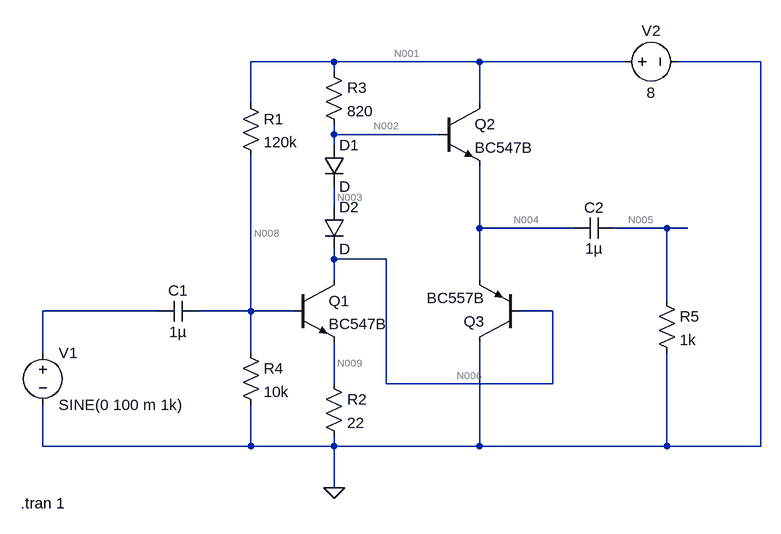
[diagram p0: schematic classAB.asc]
classAB.asc, the LTspice schematic file:
Version 4
SHEET 1 880 696
WIRE 128 0 0 0
WIRE 352 0 128 0
WIRE 576 0 352 0
WIRE 784 0 656 0
WIRE 128 16 128 0
WIRE 0 64 0 0
WIRE 352 64 352 0
WIRE 128 112 128 96
WIRE 288 112 128 112
WIRE 128 128 128 112
WIRE 128 224 128 192
WIRE 352 256 352 160
WIRE 496 256 352 256
WIRE 640 256 560 256
WIRE 672 256 640 256
WIRE 128 304 128 288
WIRE 208 304 128 304
WIRE 128 336 128 304
WIRE 352 336 352 256
WIRE 640 368 640 256
WIRE -144 384 -320 384
WIRE 0 384 0 144
WIRE 0 384 -80 384
WIRE 64 384 0 384
WIRE 464 384 416 384
WIRE -320 448 -320 384
WIRE 0 448 0 384
WIRE 128 496 128 432
WIRE 208 496 208 304
WIRE 464 496 464 384
WIRE 464 496 208 496
WIRE -320 592 -320 528
WIRE 0 592 0 528
WIRE 0 592 -320 592
WIRE 128 592 128 576
WIRE 128 592 0 592
WIRE 352 592 352 432
WIRE 352 592 128 592
WIRE 640 592 640 448
WIRE 640 592 352 592
WIRE 784 592 784 0
WIRE 784 592 640 592
WIRE 128 656 128 592
FLAG 128 656 0
SYMBOL res -16 48 R0
SYMATTR InstName R1
SYMATTR Value 120k
SYMBOL res 112 0 R0
SYMATTR InstName R3
SYMATTR Value 820
SYMBOL diode 112 128 R0
SYMATTR InstName D1
SYMBOL diode 112 224 R0
SYMATTR InstName D2
SYMBOL npn 64 336 R0
SYMATTR InstName Q1
SYMATTR Value BC547B
SYMBOL npn 288 64 R0
SYMATTR InstName Q2
SYMATTR Value BC547B
SYMBOL res 112 480 R0
SYMATTR InstName R2
SYMATTR Value 22
SYMBOL res -16 432 R0
SYMATTR InstName R4
SYMATTR Value 10k
SYMBOL cap -80 368 R90
WINDOW 0 0 32 VBottom 2
WINDOW 3 32 32 VTop 2
SYMATTR InstName C1
SYMATTR Value 1µ
SYMBOL cap 560 240 R90
WINDOW 0 0 32 VBottom 2
WINDOW 3 32 32 VTop 2
SYMATTR InstName C2
SYMATTR Value 1µ
SYMBOL res 624 352 R0
SYMATTR InstName R5
SYMATTR Value 1k
SYMBOL pnp 416 432 R180
SYMATTR InstName Q3
SYMATTR Value BC557B
SYMBOL voltage -320 432 R0
WINDOW 123 0 0 Left 0
WINDOW 39 0 0 Left 0
SYMATTR InstName V1
SYMATTR Value SINE(0 100 m 1k)
SYMBOL voltage 560 0 R270
WINDOW 0 32 56 VTop 2
WINDOW 3 -32 56 VBottom 2
WINDOW 123 0 0 Left 0
WINDOW 39 0 0 Left 0
SYMATTR InstName V2
SYMATTR Value 8
TEXT -354 680 Left 2 !.tran 1

The netlist it stands for:
* classAB.asc
R1 N001 N008 120k
R3 N001 N002 820
D1 N002 N003 D
D2 N003 N006 D
Q1 N006 N008 N009 0 BC547B
Q2 N001 N002 N004 0 BC547B
R2 N009 0 22
R4 N008 0 10k
C1 N008 N007 1µ
C2 N005 N004 1µ
R5 N005 0 1k
Q3 0 N006 N004 0 BC557B
V1 N007 0 SINE(0 100 m 1k)
V2 N001 0 8
.model D D
.lib standard.dio
.model NPN NPN
.model PNP PNP
.lib standard.bjt
.tran 1
.backanno
.end

* Results of the author's LTspice run, read from the files saved beside the schematic
* Operating Point, zero values left out:
*   V(n001) = 8 V
*   V(n008) = 607.4 mV
*   V(n002) = 7.781 V
*   V(n003) = 7.16 V
*   V(n006) = 6.539 V
*   V(n009) = 5.882 mV
*   V(n004) = 7.15 V
*   Ic(Q3) = -729 µA
*   Ib(Q3) = -1.714 µA
*   Ie(Q3) = 730.7 µA
*   Ic(Q2) = 728.1 µA
*   Ib(Q2) = 2.567 µA
*   Ie(Q2) = -730.7 µA
*   Ic(Q1) = 266.5 µA
*   Ib(Q1) = 860.1 nA
*   Ie(Q1) = -267.4 µA
*   I(D2) = 264.8 µA
*   I(D1) = 264.8 µA
*   I(R4) = 60.74 µA
*   I(R2) = 267.4 µA
*   I(R3) = 267.4 µA
*   I(R1) = 61.6 µA
*   I(V2) = -1.057 mA
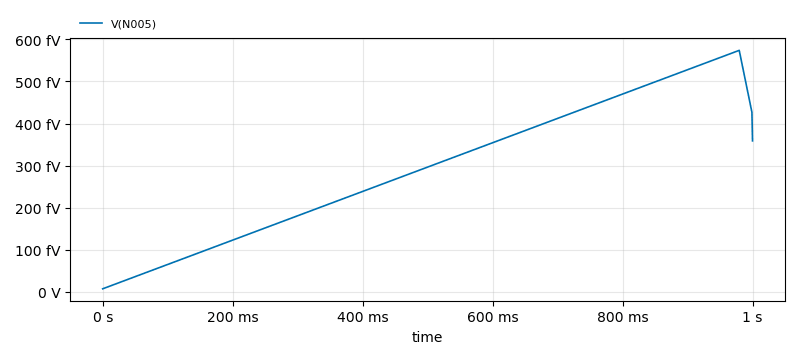
[diagram p1: Transient Analysis of classAB.asc, plotted from the saved traces]
* Transient Analysis, 1 run:
*   V(N005): min 7.15 fV, max 574 fV, average 294.8 fV, rms 408.1 fV, last 358.8 fV